# EAGLE design fallBz (EAGLE 7.2.0)
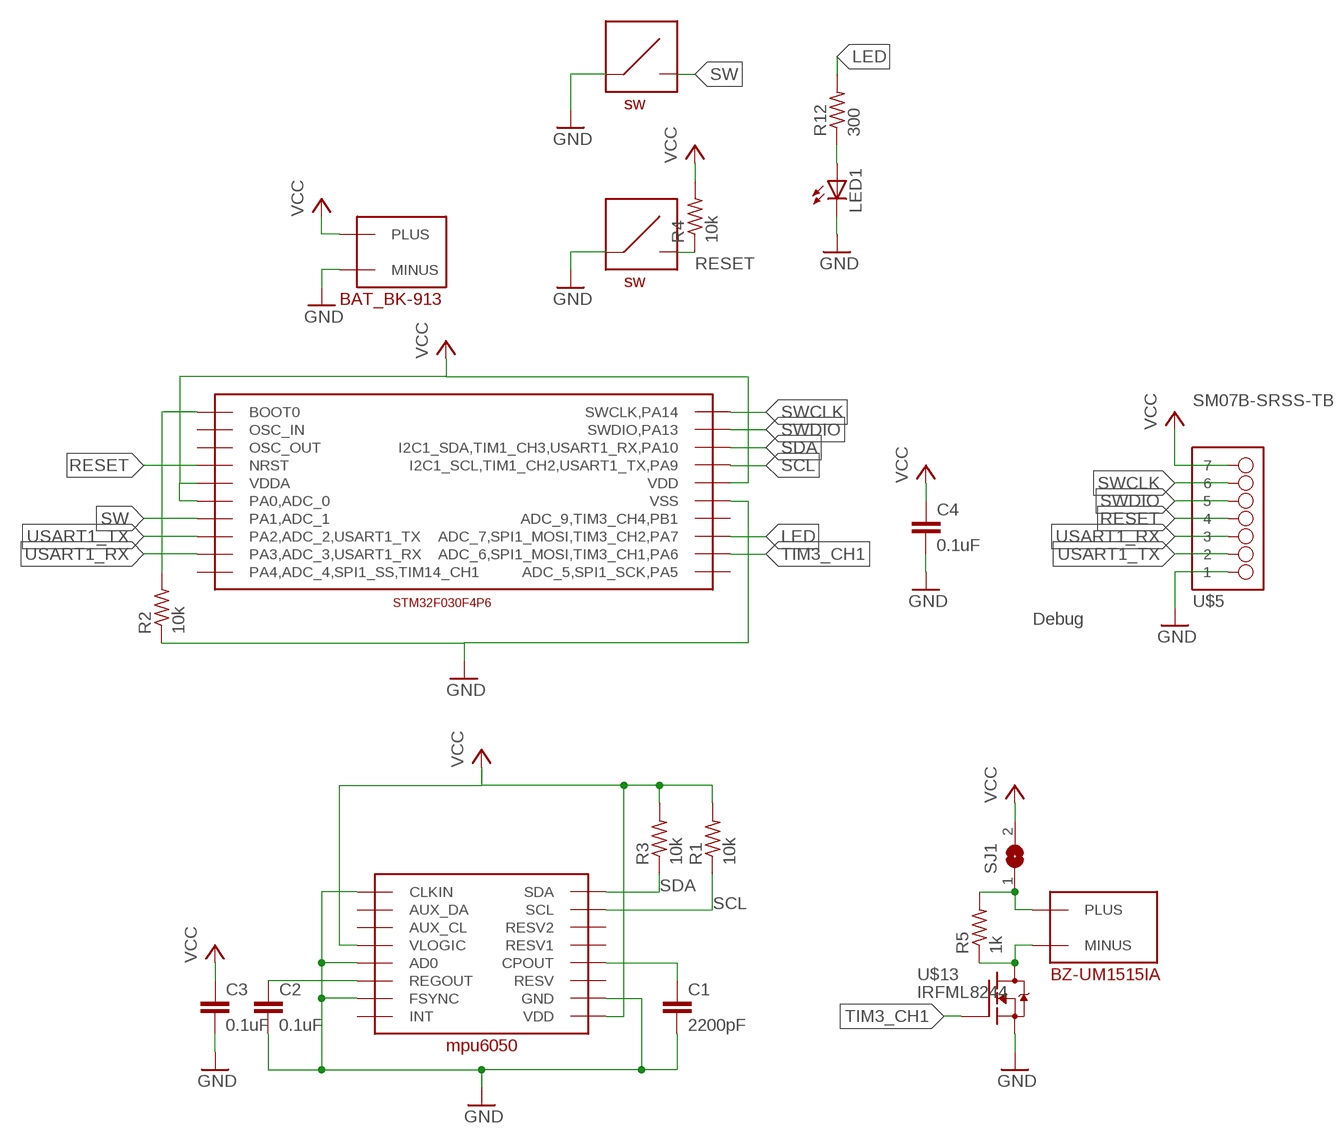
[diagram p0: schematic, sheet 1]

## Parts
C1  2200pF  C-EUC0603K  [C0603K]
C2  0.1uF  C-EUC0603K  [C0603K]
C3  0.1uF  C-EUC0603K  [C0603K]
C4  0.1uF  C-EUC0603K  [C0603K]
GH  BAT_BK-913  [BAT_BK-913]
LED1  LEDCHIP-LED0603  [CHIP-LED0603]
R1  10k  R-US_R0603  [R0603]
R2  10k  R-US_R0603  [R0603]
R3  10k  R-US_R0603  [R0603]
R4  10k  R-US_R0603  [R0603]
R5  1k  R-US_R0603  [R0603]
R12  300  R-US_R0603  [R0603]
SJ1  SJ  [SJ]
U$1  STM-TSSOP20  [STM-TSSOP20]
U$2  BZ-UM1515IA  [BZ-UM1515IA]
U$3  MPU6050  [MPU6050]
U$4  KMT071-NGJ-LHS  [KMT071-NGJ-LHS]
U$5  SM07B-SRSS-TB  [SM07B-SRSS-TB]
U$7  KMT071-NGJ-LHS  [KMT071-NGJ-LHS]
U$13  IRFML8244  [SOT23]

## Nets
GND: C1.2 C2.2 C3.2 C4.2 GH.MINUS LED1.C R2.1 U$1.P$15(VSS) U$3.AD0 U$3.CLKIN U$3.FSYNC U$3.GND U$4.SW00 U$4.SW0 U$5.P$1 U$7.SW00 U$7.SW0 U$13.2(S)
LED: R12.2 U$1.P$13(ADC_7,SPI1_MOSI,TIM3_CH2,PA7)
N$1: C2.1 U$3.REGOUT
N$2: R5.1 U$2.MINUS U$13.3(D)
N$3: R5.2 SJ1.1 U$2.PLUS
N$5: C1.1 U$3.CPOUT
N$8: R2.2 U$1.P$1(BOOT0)
N$16: LED1.A R12.1
RESET: R4.1 U$1.P$4(NRST) U$5.P$4 U$7.SW1 U$7.SW11
SCL: R1.1 U$1.P$17(I2C1_SCL,TIM1_CH2,USART1_TX,PA9) U$3.SCL
SDA: R3.1 U$1.P$18(I2C1_SDA,TIM1_CH3,USART1_RX,PA10) U$3.SDA
SW: U$1.P$7(PA1,ADC_1) U$4.SW1 U$4.SW11
SWCLK: U$1.P$20(SWCLK,PA14) U$5.P$6
SWDIO: U$1.P$19(SWDIO,PA13) U$5.P$5
TIM3_CH1: U$1.P$12(ADC_6,SPI1_MOSI,TIM3_CH1,PA6) U$13.1(G)
USART1_RX: U$1.P$9(PA3,ADC_3,USART1_RX) U$5.P$3
USART1_TX: U$1.P$8(PA2,ADC_2,USART1_TX) U$5.P$2
VCC: C3.1 C4.1 GH.PLUS0(PLUS) GH.PLUS1(PLUS) R1.2 R3.2 R4.2 SJ1.2 U$1.P$5(VDDA) U$1.P$6(PA0,ADC_0) U$1.P$16(VDD) U$3.VDD U$3.VLOGIC U$5.P$7
Unconnected: U$1.P$2(OSC_IN) U$1.P$3(OSC_OUT) U$1.P$10(PA4,ADC_4,SPI1_SS,TIM14_CH1) U$1.P$11(ADC_5,SPI1_SCK,PA5) U$1.P$14(ADC_9,TIM3_CH4,PB1) U$3.AUX_CL U$3.AUX_DA U$3.INT U$3.RESV U$3.RESV1 U$3.RESV2

## Notes on the sheet
- Debug

## Library data of the parts
C1-C4 = resistor:C-EU: CAPACITOR, European symbol
GH = BAT_BK-913:BAT_BK-913
LED1 = led:LED: LED OSRAM: - CHIPLED LG R971, LG N971, LY N971, LG Q971, LY Q971, LO R971, LY R971 LH N974, LH R974 LS Q976, LO Q976, LY Q976 LO Q996 - Hyper CHIPLED LW Q18S LB Q993, LB Q99A, LB R99A - SideLED LS A670, LO A670, LY A670, LG A670, LP A670 LB A673, LV A673, LT A673, LW A673 LH A674 LY A675 LS A676, LA A676, LO A676, LY A676, LW A676 LS A679, LY A679, LG A679 - Hyper Micro SIDELED® LS Y876, LA Y876, LO Y876, LY Y876 LT Y87S - SmartLED LW L88C, LW L88S LB L89C, LB L89S, LG L890 LS L89K, LO L89K, LY L89K LS L896, LA L896, LO L896, LY L896 - TOPLED LS T670, LO T670, LY T670, LG T670, LP T670 LSG T670, LSP T670, LSY T670, LOP T670, LYG T670 LG T671, LOG T671, LSG T671 LB T673, LV T673, LT T673, LW T673 LH T674 LS T676, LA T676, LO T676, LY T676, LB T676, LH T676, LSB T676, LW T676 LB T67C, LV T67C, LT T67C, LS T67K, LO T67K, LY T67K, LW E67C LS E67B, LA E67B, LO E67B, LY E67B, LB E67C, LV E67C, LT E67C LW T67C LS T679, LY T679, LG T679 LS T770, LO T770, LY T770, LG T770, LP T770 LB T773, LV T773, LT T773, LW T773 LH T774 LS E675, LA E675, LY E675, LS T675 LS T776, LA T776, LO T776, LY T776, LB T776 LHGB T686 LT T68C, LB T68C - Hyper Mini TOPLED® LB M676 - Mini TOPLED Santana® LG M470 LS M47K, LO M47K, LY M47K Source: http://www.osram.convergy.de LUXEON: - LUMILED® LXK2-PW12-R00, LXK2-PW12-S00, LXK2-PW14-U00, LXK2-PW14-V00 LXK2-PM12-R00, LXK2-PM12-S00, LXK2-PM14-U00 LXK2-PE12-Q00, LXK2-PE12-R00, LXK2-PE12-S00, LXK2-PE14-T00, LXK2-PE14-U00 LXK2-PB12-K00, LXK2-PB12-L00, LXK2-PB12-M00, LXK2-PB14-N00, LXK2-PB14-P00, LXK2-PB14-Q00 LXK2-PR12-L00, LXK2-PR12-M00, LXK2-PR14-Q00, LXK2-PR14-R00 LXK2-PD12-Q00, LXK2-PD12-R00, LXK2-PD12-S00 LXK2-PH12-R00, LXK2-PH12-S00 LXK2-PL12-P00, LXK2-PL12-Q00, LXK2-PL12-R00 Source: www.luxeon.com KINGBRIGHT: KA-3528ASYC Source: www.kingbright.com
R1-R5 R12 = resistor:R-US_: RESISTOR, American symbol
SJ1 = jumper:SJ: SMD solder JUMPER
U$1 = STM-tssop20:STM-TSSOP20
U$2 = BZ-UM1515IA:BZ-UM1515IA
U$3 = MPU6050:MPU6050
U$4 U$7 = KMT071-NGJ-LHS:KMT071-NGJ-LHS
U$5 = con-jst-sh:SM07B-SRSS-TB
U$13 = transistor-fet:IRFML8244

## Board
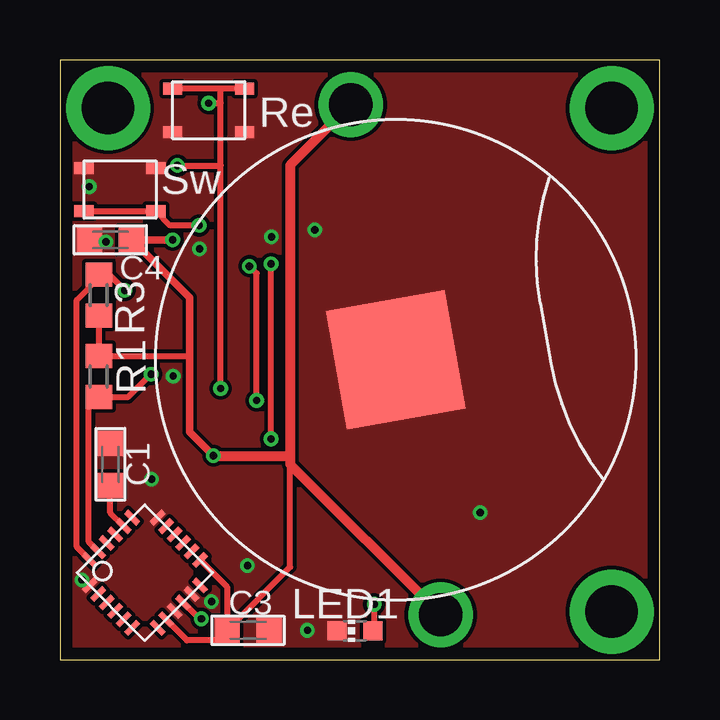
[diagram p1: board, top side]
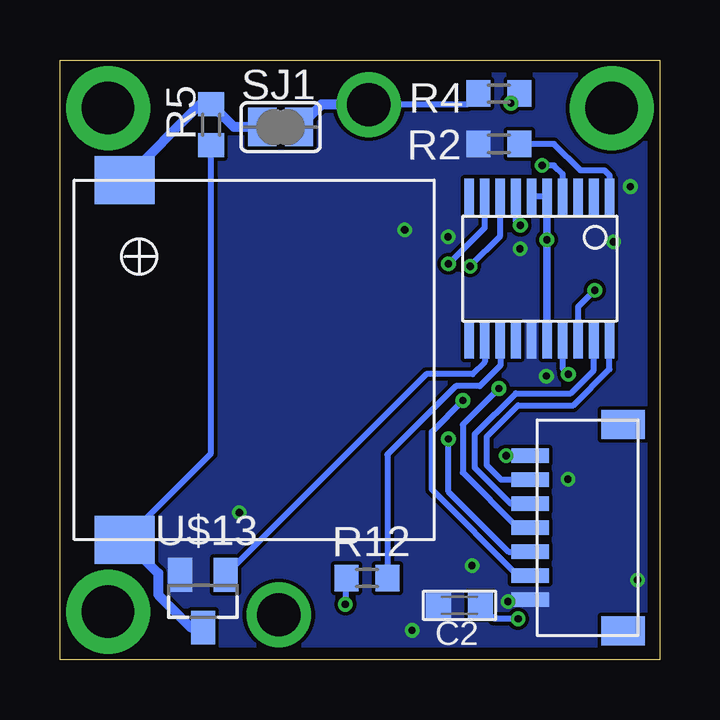
[diagram p2: board, bottom side, seen from below]

Size 25 x 25 mm. Coordinates in mm from the lower left corner, seen from the top.
Outline: 0,0 25,0 25,25 0,25 0,0
Copper layers (1*16): Top 0.035mm / dielectric 1.6mm / Bottom 0.035mm
Design rules "Elecrow_2-layer_PCB_eagle_rule": minimum track width 6mil, minimum drill 12mil, track to track 6mil, track to pad 6mil, pad to pad 6mil, via to via 8mil, smd to smd 0mil, copper to edge 20mil, drill to drill 10mil, minimum pad ring 6mil, minimum via ring 6mil, stop-mask expansion 0mil, vias tented up to drill 100mil, thermal gap 10mil

### Footprints (pad centres in the part's own frame; a part is rotated, then mirrored left to right if it is on the bottom)
C0603K = smd 1.05 x 1.08: 1 -0.875,0; 2 0.875,0
BAT_BK-913 = smd 5 x 5: MINUS 0,0 | drill 1.8: PLUS0 -10.8,0; PLUS1 10.8,0
CHIP-LED0603 = smd 0.8 x 0.8: A 0,-0.75; C 0,0.75
R0603 = smd 1 x 1.1: 1 -0.85,0; 2 0.85,0
SJ = smd 1.168 x 1.6: 1 -0.762,0; 2 0.762,0
STM-TSSOP20 = smd 0.4 x 1.5: P$1 -2.8,-3; P$2 -2.15,-3; P$3 -1.5,-3; P$4 -0.85,-3; P$5 -0.2,-3; P$6 0.45,-3; P$7 1.1,-3; P$8 1.75,-3; P$9 2.4,-3; P$10 3.05,-3; P$11 3.05,3; P$12 2.4,3; P$13 1.75,3; P$14 1.1,3; P$15 0.45,3; P$16 -0.2,3; P$17 -0.85,3; P$18 -1.5,3; P$19 -2.15,3; P$20 -2.8,3
BZ-UM1515IA = smd 2 x 2.5: MINUS 7.5,-5.4; PLUS -7.5,-5.4
MPU6050 = smd 0.25 x 0.7: AD0 -0.25,-2; AUX_CL -1.25,-2; CPOUT 0.75,2; FSYNC 0.75,-2; INT 1.25,-2; REGOUT 0.25,-2; RESV 1.25,2; RESV1 0.25,2; RESV2 -0.25,2; SCL -0.75,2; SDA -1.25,2; VLOGIC -0.75,-2 | smd 0.7 x 0.25: AUX_DA -2,-1.25; CLKIN -2,1.25; GND 2,1.25; P$2 -2,0.75; P$3 -2,0.25; P$4 -2,-0.25; P$5 -2,-0.75; P$14 2,-0.75; P$15 2,-0.25; P$16 2,0.25; P$17 2,0.75; VDD 2,-1.25
KMT071-NGJ-LHS = smd 0.8 x 0.5: SW0 -1.5,0.9; SW00 1.5,0.9; SW1 1.5,-0.9; SW11 -1.5,-0.9
SM07B-SRSS-TB = smd 0.6 x 1.55: P$1 -3,0; P$2 -2,0; P$3 -1,0; P$4 0,0; P$5 1,0; P$6 2,0; P$7 3,0 | smd 1.2 x 1.8: P$8 -4.3,-3.875; P$9 4.3,-3.875
SOT23 = smd 1 x 1.4: 1 -0.95,-1.1; 2 0.95,-1.1; 3 0,1.1

### Placement (x,y rotation side)
C1  2.1,8.14 90 top
C2  8.34,2.26 180 bottom
C3  7.84,1.22 0 top
C4  2.1,17.5 180 top
GH  14,12.5 280 top
LED1  12.3,1.2 90 top
R1  1.62,11.8 90 top
R2  6.7,21.5 0 bottom
R3  1.62,15.2 270 top
R4  6.7,23.6 180 bottom
R5  18.7,22.3 90 bottom
R12  12.2,3.4 0 bottom
SJ1  15.8,22.2 0 bottom
U$1  4.89,16.3 180 bottom
U$2  16.9,12.5 270 bottom
U$3  3.54,3.62 45 top
U$4  2.5,19.6 0 top
U$5  5.4,5.5 90 bottom
U$7  6.2,22.9 180 top
U$13  19.04,2.43 180 bottom

### Tracks (layer width: path | path; a pad name or v marks a point on that pad's centre or on a via)
GND  (via drill 0.3)
  other vias: 6.32,2.42 7.82,3.92 10.32,1.22 4.72,11.82 5.82,17.12 10.62,17.92 17.52,6.12 3.82,7.52 1.22,19.72 8.82,17.62 0.92,3.32 1.92,17.42
  pour Bottom (no thermals): -1.2,26.3 27,26.3 27,-1.4 -1.2,-1.4
  pour Top (no thermals): -2,27 29.7,27 29.7,-3.1 -2,-3.1
LED
  Bottom 0.254: U$1.P$13 6.64,12.26 7.5,11.4 8.5,11.4 11.35,8.55 R12.2
N$1  (via drill 0.3)
  Top 0.254: U$3.REGOUT 5.81,1.7 v5.9,1.7
  Bottom 0.254: 7.21,2 C2.1 6.91,1.7 v5.9,1.7
N$2
  Bottom 0.254: R5.1 18.7,8.6 U$2.MINUS
  Bottom 0.406: U$2.MINUS 20.9,3.6 20.9,2.7 19.53,1.33 U$13.3
N$3
  Bottom 0.406: SJ1.1 17.75,22.2 R5.2 19.15,23.15 U$2.PLUS
N$4  (via drill 2.2 pad 3.5)
  other vias: 2,23
N$5
  Top 0.254: U$3.CPOUT 2.1,6.12 C1.1
N$6  (via drill 2.2 pad 3.5)
  other vias: 23,23
N$7  (via drill 2.2 pad 3.5)
  other vias: 23,2
N$8
  Bottom 0.254: U$1.P$1 2.09,20.19 2.3,20.4 3.3,20.4 4.4,21.5 R2.2
N$16  (via drill 0.3)
  Top 0.254: v13.1,2.3 13.1,1.25 LED1.A
  Bottom 0.254: R12.1 13.1,3.35 v13.1,2.3
RESET  (via drill 0.3)
  Top 0.254: U$7.SW11 6.7,23.8 | 6.7,23.8 U$7.SW1 | v6.7,11.3 6.7,20.6 | 6.7,20.6 6.7,23.2 | 6.7,23.2 6.7,23.8 | v6.2,23.2 6.7,23.2 | v4.9,20.6 6.7,20.6
  Bottom 0.254: U$5.P$4 5.9,5.5 8.2,7.8 8.2,9.8 v6.7,11.3 | 5.7,23.3 5.75,23.3 R4.1 6.2,23.25 v6.2,23.2 | U$1.P$4 4.04,20.24 4.4,20.6 v4.9,20.6
SCL  (via drill 0.3)
  Top 0.254: U$3.SCL 1.2,4.9 1.2,10.53 R1.1 2.85,10.95 v3.8,11.9
  Bottom 0.254: v3.8,11.9 4.04,12.14 U$1.P$17
SDA  (via drill 0.3)
  Top 0.254: U$3.SDA 0.7,4.69 0.7,15 1.62,15.92 R3.1 2.05,16.05 v2.7,15.4
  Bottom 0.254: U$1.P$18 3.39,14.71 v2.7,15.4
SW  (via drill 0.3)
  Top 0.254: U$4.SW11 U$4.SW1 4.6,18.1 v5.8,18.1
  Bottom 0.254: U$1.P$7 5.99,18.29 v5.8,18.1
SWCLK
  Bottom 0.254: U$5.P$6 6.6,7.5 7.2,8.1 7.2,9.3 5.9,10.6 3.6,10.6 2.09,12.11 U$1.P$20
SWDIO
  Bottom 0.254: U$5.P$5 6.2,6.5 7.7,8 7.7,9.4 6,11.1 3.7,11.1 2.74,12.06 U$1.P$19
TIM3_CH1
  Bottom 0.254: U$1.P$12 7.29,12.41 7.8,11.9 9.72,11.9 U$13.1
USART1_RX  (via drill 0.3)
  Top 0.254: v8.8,9.2 v8.8,16.5
  Bottom 0.254: U$5.P$3 6.3,4.5 8.8,7 v8.8,9.2 | v8.8,16.5 7.29,18.01 U$1.P$9
USART1_TX  (via drill 0.3)
  Top 0.254: v8.2,10.8 8.2,16.1 v7.9,16.4
  Bottom 0.254: U$5.P$2 5.9,3.5 9.5,7.1 9.5,9.5 v8.2,10.8 | v7.9,16.4 6.64,17.66 U$1.P$8
VCC  (via drill 0.3)
  Top 0.254: U$3.VDD 6.96,3.02 C3.1 | U$3.VLOGIC 5.3,0.8 6.54,0.8 C3.1 | C3.1 9.6,3.85 9.6,9 | R3.2 R1.2 5.35,12.65 5.4,12.6
  Top 0.305: v6.4,8.5 5.4,9.5 5.4,12.6 5.4,15.1 3,17.5 C4.1 v4.7,17.5
  Top 0.406: GH.PLUS0 9.6,20.61 9.6,9 9.6,8.5 | 9.6,8.5 9.6,8.14 GH.PLUS1 | v6.4,8.5 9.6,8.5
  Bottom 0.254: R4.2 8.01,23.14 GH.PLUS0 | U$1.P$5 U$1.P$6
  Bottom 0.305: U$1.P$5 v4.7,17.5 U$1.P$16
  Bottom 0.406: U$5.P$7 v6.4,8.5 | GH.PLUS0 14.1,23.14 SJ1.2

### Text on the board
tPlace: Re | Sw